# EAGLE design temphumidity_1.0 (EAGLE 9.6.2)

## Sheet 1 of 2
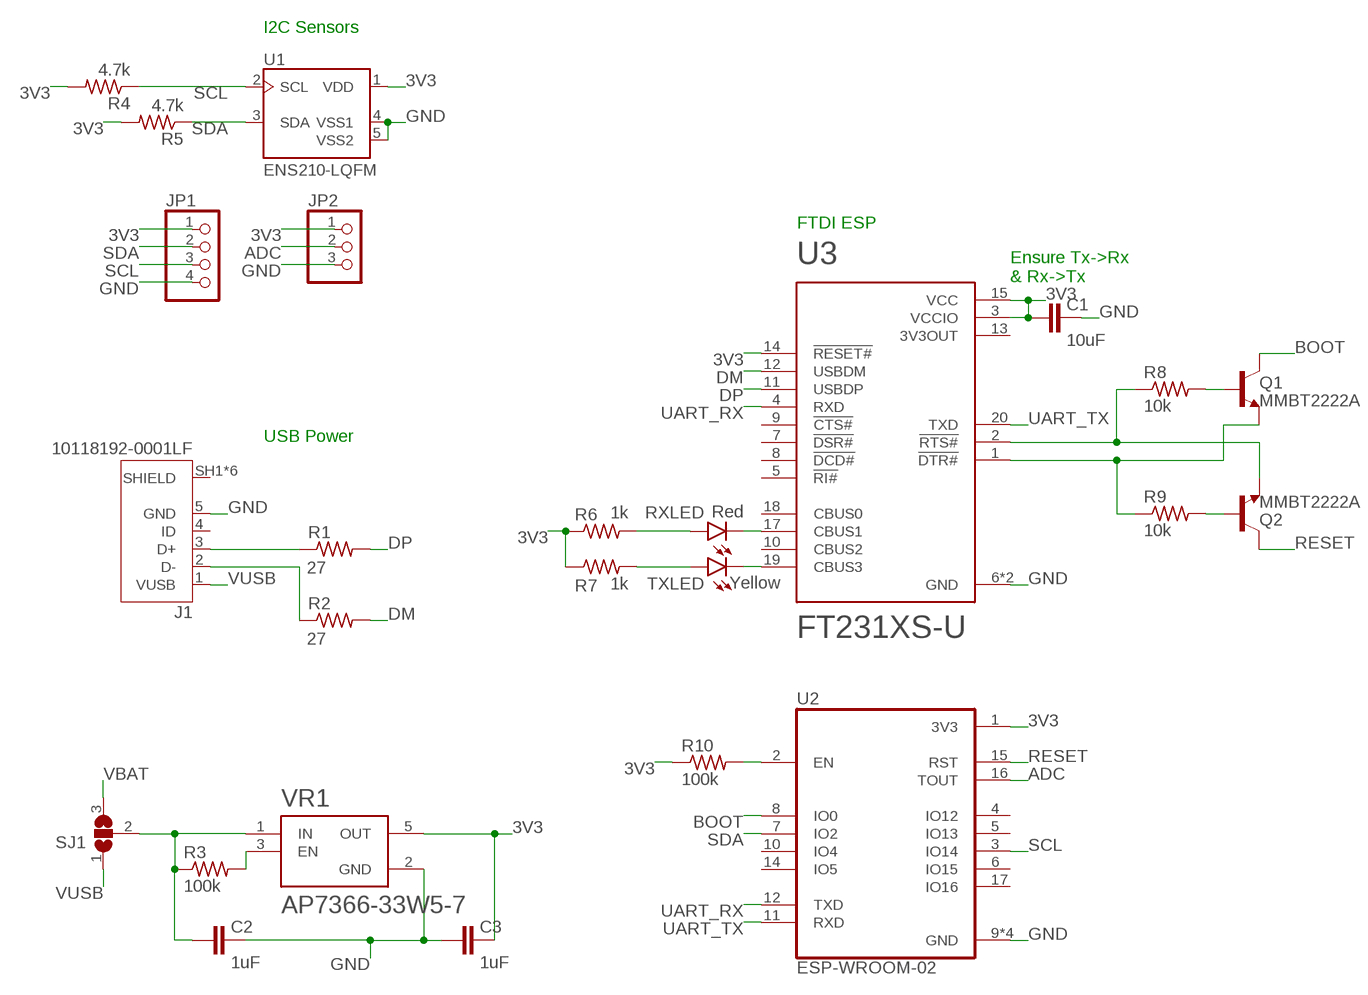
[diagram p0: schematic, sheet 1]

### Parts
C1  10uF  C-EUC0805  [C0805]
C2  1uF  C-EUC0805  [C0805]
C3  1uF  C-EUC0805  [C0805]
J1  10118192-0001LF  [AMPHENOL_10118192-0001LF]
JP1  PINHD-1X4  [1X04]
JP2  PINHD-1X3  [1X03]
Q1  MMBT2222A  [SOT23]
Q2  MMBT2222A  [SOT23]
R1  27  R-US_R0805  [R0805]
R2  27  R-US_R0805  [R0805]
R3  100k  R-US_R0805  [R0805]
R4  4.7k  R-US_R0805  [R0805]
R5  4.7k  R-US_R0805  [R0805]
R6  1k  R-US_R0805  [R0805]
R7  1k  R-US_R0805  [R0805]
R8  10k  R-US_R0805  [R0805]
R9  10k  R-US_R0805  [R0805]
R10  100k  R-US_R0805  [R0805]
RXLED  Red  LEDCHIP-LED0805  [CHIP-LED0805]
SJ1  SJ2W  [SJ_2]
TXLED  Yellow  LEDCHIP-LED0805  [CHIP-LED0805]
U1  ENS210-LQFM  [SON95P200X200X80-5N160X70]
U2  ESP-WROOM-02  [MODULE_ESP-WROOM-02]
U3  FT231XS-U  [SOP63P600X175-20N]
VR1  AP7366-33W5-7  [SOT95P285X140-5N]

### Nets
3V3: C1.2 C3.1 JP1.1 JP2.1 R4.2 R5.2 R6.1 R7.1 R10.1 U1.1(VDD) U2.1(3V3) U3.3(VCCIO) U3.14(!RESET#) U3.15(VCC) VR1.5(OUT)
ADC: JP2.2 U2.16(TOUT)
BOOT: Q1.3(C) U2.8(IO0)
DM: R2.2 U3.12(USBDM)
DP: R1.2 U3.11(USBDP)
GND: C1.1 C2.1 C3.2 J1.5(GND) JP1.4 JP2.3 U1.4(VSS1) U1.5(VSS2) U2.9(GND) U2.13(GND) U2.18(GND) U2.19(GND) U3.6(GND) U3.16(GND) VR1.2(GND) ; also sheet 2
N$1: J1.3(D+) R1.1
N$2: J1.2(D-) R2.1
N$3: R3.2 VR1.3(EN)
N$4: Q2.2(E) R8.1 U3.2(!RTS#)
N$6: Q1.2(E) R9.1 U3.1(!DTR#)
N$7: RXLED.C U3.17(CBUS1)
N$8: TXLED.C U3.19(CBUS3)
N$9: R6.2 RXLED.A
N$10: R7.2 TXLED.A
N$11: Q1.1(B) R8.2
N$12: Q2.1(B) R9.2
N$13: R10.2 U2.2(EN)
RESET: Q2.3(C) U2.15(RST)
SCL: JP1.3 R4.1 U1.2(SCL) U2.3(IO14)
SDA: JP1.2 R5.1 U1.3(SDA) U2.7(IO2)
SELECTEDVOLTAGE: C2.2 R3.1 SJ1.2 VR1.1(IN)
UART_RX: U2.12(TXD) U3.4(RXD)
UART_TX: U2.11(RXD) U3.20(TXD)
VBAT: SJ1.3 ; also sheet 2
VUSB: J1.1(VUSB) SJ1.1 ; also sheet 2
Unconnected: J1.4(ID) J1.SH1(SHIELD) J1.SH2(SHIELD) J1.SH3(SHIELD) J1.SH4(SHIELD) J1.SH5(SHIELD) J1.SH6(SHIELD) U2.4(IO12) U2.5(IO13) U2.6(IO15) U2.10(IO4) U2.14(IO5) U2.17(IO16) U3.5(!RI#) U3.7(!DSR#) U3.8(!DCD#) U3.9(!CTS#) U3.10(CBUS2) U3.18(CBUS0)

### Notes on the sheet
- I2C Sensors
- FTDI ESP
- Ensure Tx->Rx 
  & Rx->Tx
- USB Power

## Sheet 2 of 2
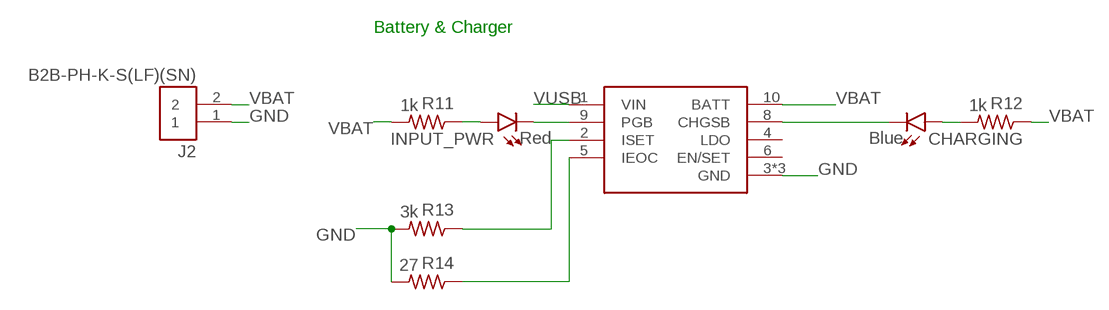
[diagram p1: schematic, sheet 2]

### Parts
CHARGING  Blue  LEDCHIP-LED0805  [CHIP-LED0805]
INPUT_PWR  Red  LEDCHIP-LED0805  [CHIP-LED0805]
J2  B2B-PH-K-S(LF)(SN)  [JST_B2B-PH-K-S(LF)(SN)]
R11  1k  R-US_R0805  [R0805]
R12  1k  R-US_R0805  [R0805]
R13  3k  R-US_R0805  [R0805]
R14  27  R-US_R0805  [R0805]
U$2  RT9532GQW  [SON50P300X300X80-11N]

### Nets
GND: J2.1 R13.2 R14.2 U$2.3(GND) U$2.7(GND) U$2.11(GND) ; also sheet 1
N$14: INPUT_PWR.C U$2.9(PGB)
N$15: CHARGING.C U$2.8(CHGSB)
N$16: INPUT_PWR.A R11.1
N$17: R13.1 U$2.2(ISET)
N$18: CHARGING.A R12.2
N$19: R14.1 U$2.5(IEOC)
VBAT: J2.2 R11.2 R12.1 U$2.10(BATT) ; also sheet 1
VUSB: U$2.1(VIN) ; also sheet 1
Unconnected: U$2.4(LDO) U$2.6(EN/SET)

### Notes on the sheet
- Battery & Charger

## Power pins joined to a net without a drawn wire
3V3OUT: U3.13(3V3OUT)

## Library data of the parts
C1-C3 = rcl:C-EU: CAPACITOR, European symbol; SPICEPREFIX: C
CHARGING INPUT_PWR RXLED TXLED = led:LED: LED OSRAM: - CHIPLED LG R971, LG N971, LY N971, LG Q971, LY Q971, LO R971, LY R971 LH N974, LH R974 LS Q976, LO Q976, LY Q976 LO Q996 - Hyper CHIPLED LW Q18S LB Q993, LB Q99A, LB R99A - SideLED LS A670, LO A670, LY A670, LG A670, LP A670 LB A673, LV A673, LT A673, LW A673 LH A674 LY A675 LS A676, LA A676, LO A676, LY A676, LW A676 LS A679, LY A679, LG A679 - Hyper Micro SIDELED® LS Y876, LA Y876, LO Y876, LY Y876 LT Y87S - SmartLED LW L88C, LW L88S LB L89C, LB L89S, LG L890 LS L89K, LO L89K, LY L89K LS L896, LA L896, LO L896, LY L896 - TOPLED LS T670, LO T670, LY T670, LG T670, LP T670 LSG T670, LSP T670, LSY T670, LOP T670, LYG T670 LG T671, LOG T671, LSG T671 LB T673, LV T673, LT T673, LW T673 LH T674 LS T676, LA T676, LO T676, LY T676, LB T676, LH T676, LSB T676, LW T676 LB T67C, LV T67C, LT T67C, LS T67K, LO T67K, LY T67K, LW E67C LS E67B, LA E67B, LO E67B, LY E67B, LB E67C, LV E67C, LT E67C LW T67C LS T679, LY T679, LG T679 LS T770, LO T770, LY T770, LG T770, LP T770 LB T773, LV T773, LT T773, LW T773 LH T774 LS E675, LA E675, LY E675, LS T675 LS T776, LA T776, LO T776, LY T776, LB T776 LHGB T686 LT T68C, LB T68C - Hyper Mini TOPLED® LB M676 - Mini TOPLED Santana® LG M470 LS M47K, LO M47K, LY M47K Source: http://www.osram.convergy.de LUXEON: - LUMILED® LXK2-PW12-R00, LXK2-PW12-S00, LXK2-PW14-U00, LXK2-PW14-V00 LXK2-PM12-R00, LXK2-PM12-S00, LXK2-PM14-U00 LXK2-PE12-Q00, LXK2-PE12-R00, LXK2-PE12-S00, LXK2-PE14-T00, LXK2-PE14-U00 LXK2-PB12-K00, LXK2-PB12-L00, LXK2-PB12-M00, LXK2-PB14-N00, LXK2-PB14-P00, LXK2-PB14-Q00 LXK2-PR12-L00, LXK2-PR12-M00, LXK2-PR14-Q00, LXK2-PR14-R00 LXK2-PD12-Q00, LXK2-PD12-R00, LXK2-PD12-S00 LXK2-PH12-R00, LXK2-PH12-S00 LXK2-PL12-P00, LXK2-PL12-Q00, LXK2-PL12-R00 Source: www.luxeon.com KINGBRIGHT: KA-3528ASYC Source: www.kingbright.com
J1 = USB-Micro-Connector:10118192-0001LF: Single Port 5 Contact Horizontal Right Angle Shielded Micro B USB 2.0 Connector Check prices <https://pricing.snapeda.com/parts/10118192-0001LF/AMPHENOL%20ICC%20/%20FCI/view-part?ref=eda>; AVAILABILITY: In Stock; DESCRIPTION: USB - micro B USB 2.0 Receptacle Connector 5 Position Surface Mount, Right Angle; MF: AMPHENOL ICC / FCI; MP: 10118192-0001LF; PACKAGE: None; PRICE: None; PURCHASE-URL: https://pricing.snapeda.com/search/part/10118192-0001LF/?ref=eda
J2 = B2B-PH-K-S_LF__SN_:B2B-PH-K-S(LF)(SN): PH Series 2 Position 2 mm Pitch Through Hole Top Entry Shrouded Header Check prices <https://pricing.snapeda.com/parts/B2B-PH-K-S%28LF%29%28SN%29/JST%20Sales/view-part?ref=eda>; AVAILABILITY: In Stock; DESCRIPTION: Connector Header Through Hole 2 position 0.079 (2.00mm); MF: JST Sales; MP: B2B-PH-K-S(LF)(SN); PACKAGE: None; PRICE: None; PURCHASE-URL: https://pricing.snapeda.com/search/part/B2B-PH-K-S(LF)(SN)/?ref=eda
JP1 = pinhead:PINHD-1X4: PIN HEADER
JP2 = pinhead:PINHD-1X3: PIN HEADER
Q1 Q2 = MMBT2222A:MMBT2222A: 2N2222 General Purpose NPN Transistor Check prices <https://pricing.snapeda.com/parts/MMBT2222A/ON%20Semiconductor/view-part?ref=eda>; AVAILABILITY: In Stock; DESCRIPTION: Bipolar (BJT) Transistor NPN 40V 600mA 300MHz 330mW Surface Mount SOT-23-3; MF: ON Semiconductor; MP: MMBT2222A; PACKAGE: SC-75 ON Semiconductor; PRICE: None; PURCHASE-URL: https://pricing.snapeda.com/search/part/MMBT2222A/?ref=eda
R1-R14 = rcl:R-US_: RESISTOR, American symbol; SPICEPREFIX: R
SJ1 = jumper:SJ2W: SMD solder JUMPER
U1 = ENS210-LQFM:ENS210-LQFM: ENS210 Series 3.6V 100%RH Relative Humidity & Temperature Sensor w/I²C Interface Check prices <https://pricing.snapeda.com/parts/ENS210-LQFM/ams/view-part?ref=eda>; AVAILABILITY: In Stock; DESCRIPTION: Humidity Temperature Sensor 0 ~ 100% RH I²C ±3.5% RH 3s Surface Mount; MF: ams; MP: ENS210-LQFM; PACKAGE: QFN-4 ams; PRICE: None; PURCHASE-URL: https://pricing.snapeda.com/search/part/ENS210-LQFM/?ref=eda
U2 = ESP-WROOM-02:ESP-WROOM-02: Wi-Fi Module w/ESP8266 802.11b/g/n 20dBm 20x18x3mm Check prices <https://pricing.snapeda.com/parts/ESP-WROOM-02/Espressif%20Systems/view-part?ref=eda>; AVAILABILITY: In Stock; DESCRIPTION: WiFi 802.11b/g/n Transceiver Module 2.4GHz ~ 2.5GHz Integrated, Trace Surface Mount; MF: Espressif Systems; MP: ESP-WROOM-02; PACKAGE: SMD-18 Espressif Systems; PRICE: None; PURCHASE-URL: https://pricing.snapeda.com/search/part/ESP-WROOM-02/?ref=eda
U3 = FT231XS-U:FT231XS-U: USB Full Speed to Full Handshake UART with USB Charger Detection, SSOP-20 Check prices <https://pricing.snapeda.com/parts/FT231XS-U/FTDI%20Chip/view-part?ref=eda>; AVAILABILITY: In Stock; DESCRIPTION: USB Bridge, USB to UART USB 2.0 UART Interface 20-SSOP; MF: FTDI Chip; MP: FT231XS-U; PACKAGE: SSOP-20 FTDI; PRICE: None; PURCHASE-URL: https://pricing.snapeda.com/search/part/FT231XS-U/?ref=eda
U$2 = SON50P300X300X80-11N:RT9532GQW
VR1 = AP7366-33W5-7:AP7366-33W5-7: Linear Voltage Regulator IC 1 Output 600mA SOT-25 Check prices <https://pricing.snapeda.com/parts/AP7366-33W5-7/Diodes%20Zetex/view-part?ref=eda>; AVAILABILITY: In Stock; DESCRIPTION: LDO Regulator Pos 3.3V 0.6A 5-Pin SOT-25 T/R; MF: Diodes Zetex; MP: AP7366-33W5-7; PACKAGE: None; PRICE: None; PURCHASE-URL: https://pricing.snapeda.com/search/part/AP7366-33W5-7/?ref=eda

## Board
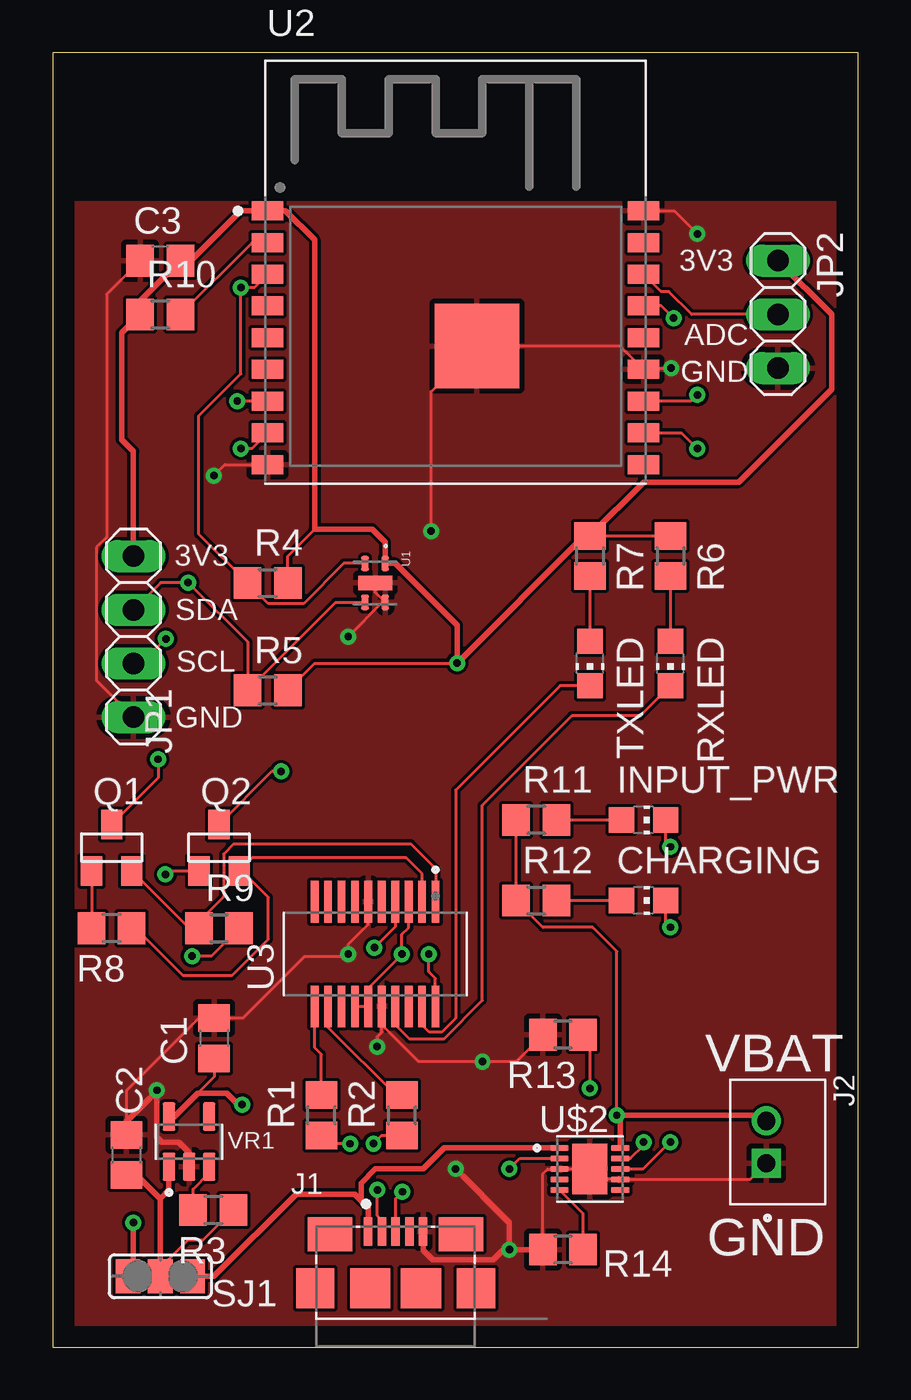
[diagram p2: board, top side]
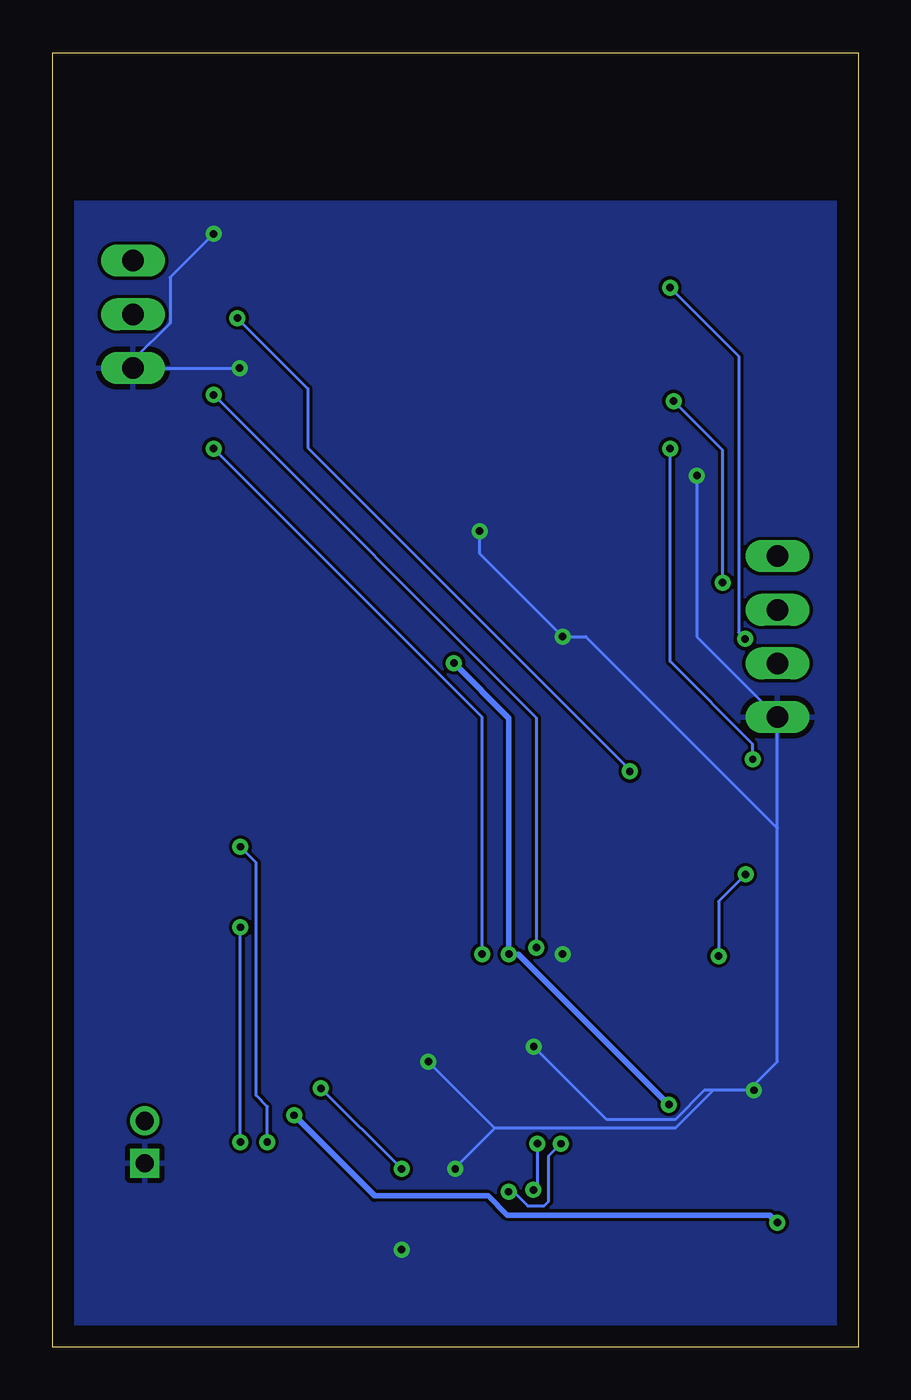
[diagram p3: board, bottom side, seen from below]

Size 38.08 x 61.21 mm. Coordinates in mm from the lower left corner, seen from the top.
Outline: 0,0 38.08,0 38.08,61.21 0,61.21 0,0
Copper layers (1*16): Top 0.035mm / dielectric 1.5mm / Bottom 0.035mm
Design rules "default *": minimum track width 6mil, minimum drill 0.35mm, track to track 6mil, track to pad 6mil, pad to pad 6mil, via to via 6mil, smd to smd 6mil, copper to edge 40mil, drill to drill 6mil, minimum pad ring 10mil, minimum via ring 8mil, stop-mask expansion 4mil, vias tented up to drill 0mil, thermal gap 10mil

### Footprints (pad centres in the part's own frame; a part is rotated, then mirrored left to right if it is on the bottom)
C0805 = smd 1.3 x 1.5: 1 -0.95,0; 2 0.95,0
CHIP-LED0805 = smd 1.2 x 1.2: A 0,-1.05; C 0,1.05
AMPHENOL_10118192-0001LF = smd 0.4 x 1.35: 1 -1.3,0; 2 -0.65,0; 3 0,0; 4 0.65,0; 5 1.3,0 | smd 2.1 x 1.6: SH1 -3.1,-0.125; SH2 3.1,-0.125 | smd 1.8 x 1.9: SH3 -3.8,-2.675; SH6 3.8,-2.675 | smd 1.9 x 1.9: SH4 -1.2,-2.675; SH5 1.2,-2.675
JST_B2B-PH-K-S(LF)(SN) = drill 0.86 square: 1 1,-0.55 | drill 0.86: 2 -1,-0.55
1X04 = drill 1.016 long: 1 -3.81,0; 2 -1.27,0; 3 1.27,0; 4 3.81,0
1X03 = drill 1.016 long: 1 -2.54,0; 2 0,0; 3 2.54,0
SOT23 = smd 1 x 1.4: 1 -0.95,-1.1; 2 0.95,-1.1; 3 0,1.1
R0805 = smd 1.3 x 1.5: 1 -0.95,0; 2 0.95,0
SJ_2 = smd 1.168 x 1.6: 1 -1.524,0; 2 0,0; 3 1.524,0
SON95P200X200X80-5N160X70 = smd 0.73 x 0.37: 1 -0.92,0.475; 2 -0.92,-0.475; 3 0.92,-0.475; 4 0.92,0.475 | smd 0.7 x 1.6: 5 0,0
MODULE_ESP-WROOM-02 = smd 1.485 x 0.9: 1 -8.893,4.9; 2 -8.893,3.4; 3 -8.893,1.9; 4 -8.893,0.4; 5 -8.893,-1.1; 6 -8.893,-2.6; 7 -8.893,-4.1; 8 -8.893,-5.6; 9 -8.893,-7.1; 10 8.893,-7.1; 11 8.893,-5.6; 12 8.893,-4.1; 13 8.893,-2.6; 14 8.893,-1.1; 15 8.893,0.4; 16 8.893,1.9; 17 8.893,3.4; 18 8.893,4.9 | smd 4 x 4: 19 1,-1.5
SOP63P600X175-20N = smd 1.97 x 0.41: 1 -2.475,2.857; 2 -2.475,2.223; 3 -2.475,1.587; 4 -2.475,0.953; 5 -2.475,0.318; 6 -2.475,-0.318; 7 -2.475,-0.953; 8 -2.475,-1.587; 9 -2.475,-2.223; 10 -2.475,-2.857; 11 2.475,-2.857; 12 2.475,-2.223; 13 2.475,-1.587; 14 2.475,-0.953; 15 2.475,-0.318; 16 2.475,0.318; 17 2.475,0.953; 18 2.475,1.587; 19 2.475,2.223; 20 2.475,2.857
SON50P300X300X80-11N = smd 0.86 x 0.28: 1 -1.435,1; 2 -1.435,0.5; 3 -1.435,0; 4 -1.435,-0.5; 5 -1.435,-1; 6 1.435,-1; 7 1.435,-0.5; 8 1.435,0; 9 1.435,0.5; 10 1.435,1 | smd 1.65 x 2.38: 11 0,0
SOT95P285X140-5N = smd 1.35 x 0.6: 1 -1.185,0.95; 2 -1.185,0; 3 -1.185,-0.95; 4 1.185,-0.95; 5 1.185,0.95

### Placement (x,y rotation side)
C1  7.62,14.61 270 top
C2  3.48,9.09 270 top
C3  5.08,51.38 180 top
CHARGING  27.94,21.13 270 top
INPUT_PWR  27.94,24.94 270 top
J1  16.21,5.47 0 top
J2  34.29,9.7 270 top
JP1  3.81,33.6 270 top
JP2  34.29,48.84 270 top
Q1  2.78,23.63 0 top
Q2  7.86,23.63 0 top
R1  12.7,10.97 90 top
R2  16.51,10.97 90 top
R3  7.58,6.48 180 top
R4  10.16,36.14 0 top
R5  10.16,31.06 0 top
R6  29.21,37.41 270 top
R7  25.4,37.41 270 top
R8  2.78,19.82 180 top
R9  7.86,19.82 0 top
R10  5.08,48.84 0 top
R11  22.86,24.94 180 top
R12  22.86,21.13 0 top
R13  24.13,14.78 180 top
R14  24.13,4.62 180 top
RXLED  29.21,32.33 180 top
SJ1  5.08,3.35 180 top
TXLED  25.4,32.33 180 top
U1  15.24,36.14 270 top
U2  19.05,48.84 0 top
U3  15.24,18.59 270 top
U$2  25.4,8.43 0 top
VR1  6.44,9.72 90 top

### Tracks (layer width: path | path; a pad name or v marks a point on that pad's centre or on a via)
3V3  (via drill 0.35)
  Top 0.152: U3.3 16.83,19.84 16.51,19.52 v16.51,18.59 16.51,18.57 14.93,16.99 U3.15 U3.14 | 25.13,38.36 R7.1 R6.1 | R10.1 4.13,49.48 | 6.53,51.38 C3.1 | R5.2 12.38,32.33 19.1,32.33 v19.12,32.35 | 12.38,38.68 11.11,37.41 R4.2 | C1.2 7.62,12.78 6.86,12.02
  Top 0.254: 25.13,38.36 v19.12,32.35 19.12,34.14 16.2,37.06 U1.1 15.71,38.07 15.11,38.68 12.38,38.68 12.38,52.36 11,53.74 U2.1 8.89,53.74 6.53,51.38 | JP1.1 3.81,42.36 3.25,42.92 3.25,47.97 R10.1 | 4.13,49.48 C3.1 | R7.1 27.95,40.91 32.44,40.91 36.83,45.3 36.83,48.84 JP2.1 | VR1.5 5.74,10.9 6.86,12.02 8.22,12.02 8.77,11.47 v8.95,11.47
  Bottom 0.152: v19.12,32.35 19.11,32.35
  Bottom 0.254: v8.95,11.47 16.07,18.59 v16.51,18.59 16.51,29.75 19.11,32.35
ADC
  Top 0.152: U2.16 28.76,49.92 29.13,49.92 30.21,48.84 JP2.2
BOOT  (via drill 0.35)
  Top 0.152: U2.8 9.41,42.49 v8.89,42.49 | v4.98,27.8 4.98,26.93 Q1.3
  Bottom 0.152: v4.98,27.8 4.98,28.52 8.89,32.43 v8.89,42.49
DM
  Top 0.152: U3.12 13.01,16.11 13.01,15.14 16.3,11.84 16.43,11.84 R2.2
DP
  Top 0.152: R1.2 12.7,13.84 12.39,14.15 12.39,16.1 U3.11
GND  (via drill 0.35)
  Top 0.152: J2.1 32.97,7.93 U$2.7 25.89,7.94 U$2.11 U$2.3 23.4,8.42 23.18,8.2 R14.2 | J1.5 17.52,5.45 | R13.2 21.91,13.51 v20.32,13.51 17.3,13.51 15.56,15.25 | 15.56,15.25 15.56,14.9 15.33,14.68 v15.33,14.22 | 15.56,15.25 U3.16 | v7.62,41.22 8.14,41.74 U2.9 | U3.6 14.92,19.99 13.97,19.04 v13.97,18.59 13.84,18.46 11.89,18.46 8.99,15.56 C1.1 6.91,15.56 3.47,12.12 3.47,10.67 C2.1 | v4.92,12.15 4.92,12.11 | v29.24,46.3 28,46.3 U2.13 27.12,47.07 27.11,47.07 26.83,47.34 U2.19 17.89,45.19 v17.89,38.59 | v13.97,33.6 15.59,35.22 U1.4 15.24,35.7 U1.5 | C3.2 2.54,49.79 2.54,38.31 2.06,37.82 2.06,31.55 JP1.4 | JP1.4 | U2.18 29.39,53.74 v30.48,52.65 | VR1.2 6.43,8.54 6.43,9.21
  Top 0.254: v21.59,4.62 R14.2 | 17.52,5.45 17.52,4.58 17.97,4.14 20.82,4.14 21.3,4.62 v21.59,4.62 | 4.92,12.11 3.47,10.67 | v19.05,8.43 21.59,5.89 v21.59,4.62 | 6.43,9.21 5.95,9.7 5.14,9.7 4.91,9.93 4.91,11.57 4.92,11.58 v4.92,12.15
  Bottom 0.152: v4.92,12.15 6.85,12.15 8.64,10.36 17.17,10.36 | 17.17,10.36 v20.32,13.51 | v7.62,41.22 7.62,33.6 JP1.4 3.81,24.55 | v29.24,46.3 JP2.3 34.29,46.68 32.54,48.43 32.54,50.6 v30.48,52.65 | v19.05,8.43 19.05,8.48 17.17,10.36 | v17.89,38.59 17.89,37.53 v13.97,33.6 12.87,33.6 3.81,24.55 | v4.92,12.15 4.92,12.4 3.81,13.51 3.81,24.55 | v4.92,12.15 7.26,12.15 8.65,10.76 11.88,10.76 v15.33,14.22
  pour Top: 0,54.15 38.1,54.15 38.1,-0.46 0,-0.46
  pour Bottom: 0,54.15 38.1,54.15 38.1,-0.46 0,-0.46
N$1  (via drill 0.35)
  Top 0.152: J1.3 16.21,7.03 v16.53,7.35 | v14.05,9.62 13.1,9.62 R1.1
  Bottom 0.152: v14.05,9.62 14.63,9.04 14.63,6.9 14.85,6.68 15.62,6.68 16.29,7.35 v16.53,7.35
N$2  (via drill 0.35)
  Top 0.152: J1.2 15.57,6.01 15.35,6.23 v15.35,7.44 | v15.16,9.63 15.55,10.02 R2.1
  Bottom 0.152: v15.16,9.63 15.16,7.62 v15.35,7.44
N$3
  Top 0.152: VR1.3 7.41,8.52 7.41,8.24 6.63,7.47 R3.2
N$4
  Top 0.152: U3.2 17.46,22.38 16.71,23.14 9.42,23.14 Q2.2 8.94,22.53 10.19,21.28 10.19,19.3 8.46,17.57 6.16,17.57 3.92,19.82 R8.1
N$6
  Top 0.152: Q1.2 6.44,19.82 6.59,19.82 | 6.59,19.82 R9.1 | U3.1 18.1,22.63 16.93,23.8 8.56,23.8 8.08,23.32 8.08,21.31 6.59,19.82
N$7
  Top 0.152: U3.17 16.19,15.25 16.84,14.59 18.51,14.59 20.32,16.4 20.32,25.63 24.55,29.86 27.78,29.86 RXLED.C
N$8
  Top 0.152: TXLED.C 23.99,31.28 19.05,26.34 19.05,15.56 18.38,14.9 17.81,14.9 17.46,15.25 17.46,16.11 U3.19
N$9
  Top 0.152: R6.2 RXLED.A
N$10
  Top 0.152: R7.2 TXLED.A
N$11
  Top 0.152: Q1.1 R8.2
N$12  (via drill 0.35)
  Top 0.152: R9.2 7.49,18.5 v6.59,18.5 | v5.32,22.36 5.49,22.53 Q2.1
  Bottom 0.152: v5.32,22.36 6.59,21.09 v6.59,18.5
N$13
  Top 0.152: R10.2 9.43,52.24 U2.2
N$14  (via drill 0.35)
  Top 0.152: v27.94,9.7 v27.94,9.69 27.94,9.55 27.32,8.93 U$2.9 | v29.21,23.67 28.99,23.89 INPUT_PWR.C
  Bottom 0.152: v27.94,9.7 27.94,11.38 28.46,11.9 28.46,22.92 v29.21,23.67
N$15  (via drill 0.35)
  Top 0.152: v29.21,9.7 29.17,9.7 27.9,8.42 U$2.8 | v29.21,19.86 28.99,20.08 CHARGING.C
  Bottom 0.152: v29.21,9.7 v29.21,19.86
N$16
  Top 0.152: R11.1 INPUT_PWR.A
N$17  (via drill 0.35)
  Top 0.152: v21.59,8.43 22.09,8.93 U$2.2 | R13.1 25.4,14.46 v25.4,12.24
  Bottom 0.152: v21.59,8.43 v25.4,12.24
N$18
  Top 0.152: R12.2 CHARGING.A
N$19
  Top 0.152: R14.1 25.08,6.31 U$2.5
RESET  (via drill 0.35)
  Top 0.152: v10.79,27.23 10.36,27.23 Q2.3 | v29.36,48.67 28.78,49.24 U2.15
  Bottom 0.152: v10.79,27.23 10.79,27.32 26.02,42.54 26.02,45.33 v29.36,48.67
SCL  (via drill 0.35)
  Top 0.152: U2.3 9.53,50.11 v8.89,50.11 8.89,46.04 6.91,44.06 6.91,38.44 R4.1 10.19,35.17 11.86,35.17 13.75,37.06 U1.2 | JP1.3 4.18,32.33 v5.34,33.5
  Bottom 0.152: v8.89,50.11 5.64,46.87 5.64,33.8 v5.34,33.5
SDA  (via drill 0.35)
  Top 0.152: U2.7 v8.73,44.74 v8.72,44.75 | JP1.2 5.1,36.16 v6.4,36.16 9.21,33.35 R5.1 13.37,35.22 U1.3
  Bottom 0.152: v6.4,36.16 6.4,42.42 v8.72,44.75
SELECTEDVOLTAGE
  Top 0.152: SJ1.2 5.08,3.75 6.38,5.05 7.09,5.05 8.52,6.48 R3.1 | C2.2 3.97,8.14
  Top 0.254: 5.08,7.02 3.97,8.14 | VR1.1 5.49,7.44 5.08,7.02 | SJ1.2 5.08,7.02
UART_RX  (via drill 0.35)
  Top 0.152: U3.4 16.19,19.88 v15.21,18.9 | v30.48,45.03 30.19,44.74 U2.12
  Bottom 0.152: v30.48,45.03 15.21,29.76 v15.21,18.9
UART_TX  (via drill 0.35)
  Top 0.152: U3.20 18.1,17.44 17.78,17.76 v17.78,18.59 | U2.11 29.73,43.24 v30.48,42.49
  Bottom 0.152: v17.78,18.59 17.78,29.79 v30.48,42.49
VBAT  (via drill 0.35)
  Top 0.152: 3.81,3.6 SJ1.3 | R11.2 R12.1 23.18,19.86 25.53,19.86 26.67,18.72 v26.67,10.97 26.84,10.8 | 33.47,10.97 J2.2
  Top 0.254: v3.81,5.89 3.81,3.6 | v26.67,10.97 33.47,10.97 | U$2.10 26.84,10.8
  Bottom 0.254: v3.81,5.89 4.17,6.25 16.58,6.25 17.49,7.16 22.86,7.16 v26.67,10.97
VUSB
  Top 0.152: U$2.1 | 14.63,6.88 14.63,6.9 14.57,6.95 | 14.91,6.62
  Top 0.254: U$2.1 18.51,9.42 17.51,8.43 15.25,8.43 14.57,7.75 14.57,6.95 | SJ1.1 7.62,3.35 11.5,7.23 14.28,7.23 14.63,6.88 | 14.63,6.9 14.91,6.62 J1.1

### Text on the board
tNames: 3V3 | ADC | GND | 3V3 | SDA | SCL | GND | VBAT | GND